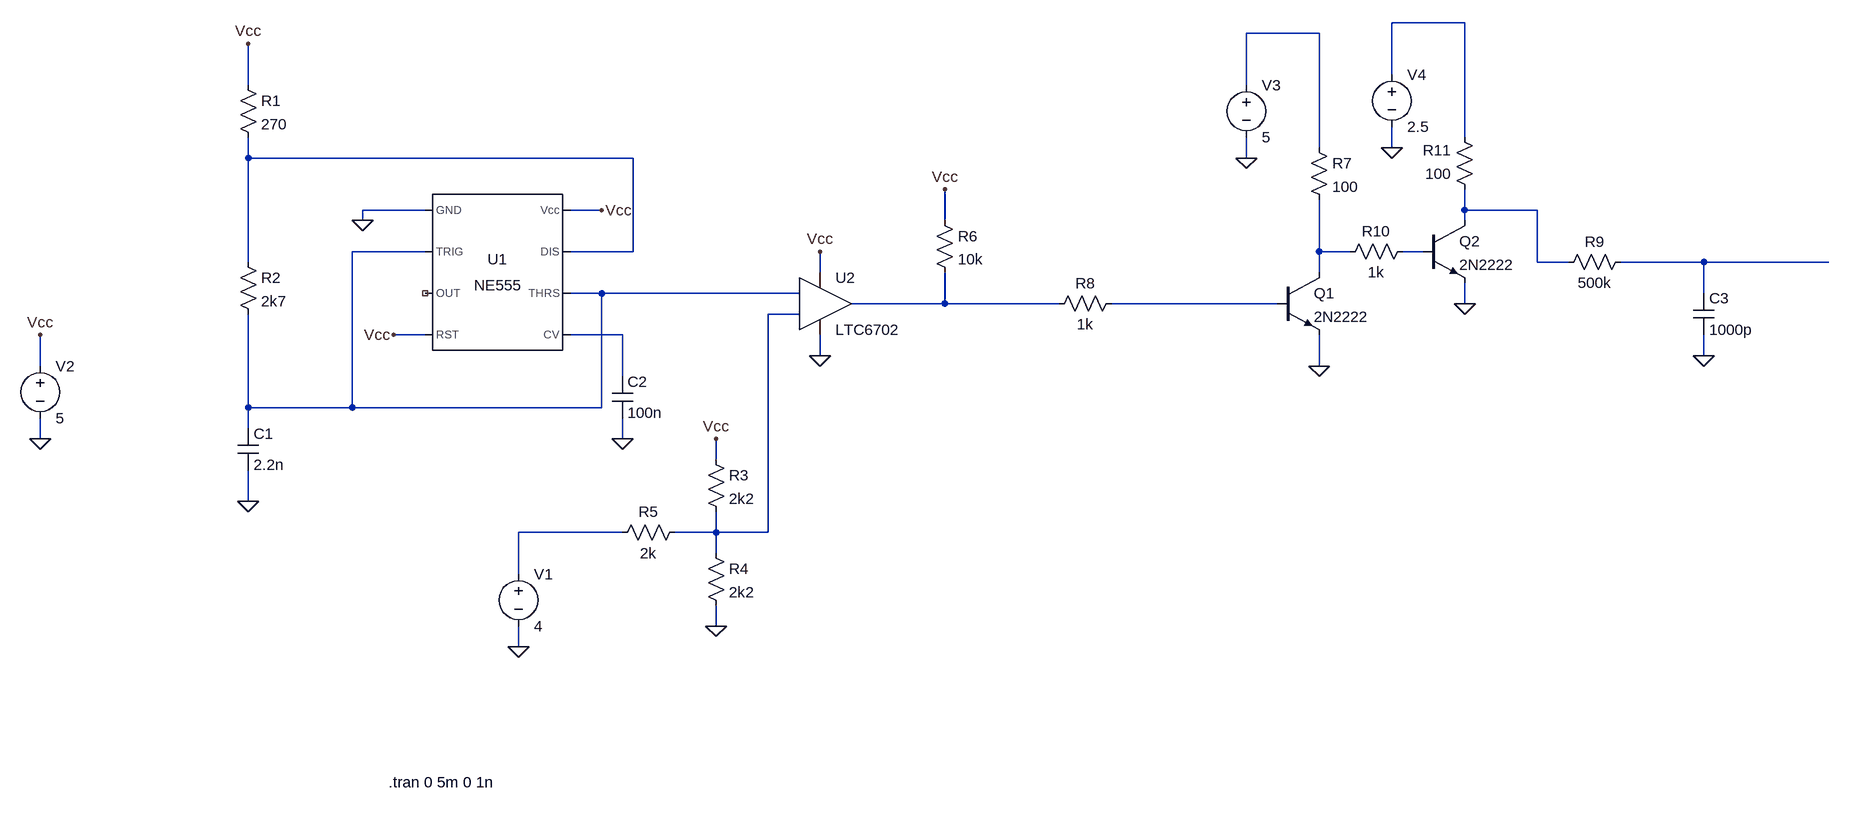
[diagram p0: schematic Gerador_PWM.asc]
Gerador_PWM.asc, the LTspice schematic file:
Version 4
SHEET 1 2724 736
WIRE 1440 -448 1328 -448
WIRE 1216 -432 1104 -432
WIRE 1328 -368 1328 -448
WIRE -432 -352 -432 -416
WIRE 1104 -352 1104 -432
WIRE 1440 -272 1440 -448
WIRE 1216 -256 1216 -432
WIRE 1328 -256 1328 -288
WIRE -432 -240 -432 -272
WIRE 160 -240 -432 -240
WIRE 1104 -240 1104 -272
WIRE -160 -160 -256 -160
WIRE 112 -160 64 -160
WIRE 1440 -160 1440 -192
WIRE 1552 -160 1440 -160
WIRE -256 -144 -256 -160
WIRE 640 -144 640 -192
WIRE 1440 -144 1440 -160
WIRE -160 -96 -272 -96
WIRE 160 -96 160 -240
WIRE 160 -96 64 -96
WIRE 1216 -96 1216 -176
WIRE 1264 -96 1216 -96
WIRE 1376 -96 1344 -96
WIRE -432 -80 -432 -240
WIRE 1552 -80 1552 -160
WIRE 1600 -80 1552 -80
WIRE 1808 -80 1680 -80
WIRE 2000 -80 1808 -80
WIRE 448 -64 448 -96
WIRE 1216 -64 1216 -96
WIRE 112 -32 64 -32
WIRE 416 -32 112 -32
WIRE 1808 -32 1808 -80
WIRE 640 -16 640 -64
WIRE 640 -16 496 -16
WIRE 816 -16 640 -16
WIRE 1152 -16 896 -16
WIRE 1440 -16 1440 -48
WIRE 416 0 368 0
WIRE -160 32 -208 32
WIRE 144 32 64 32
WIRE 448 64 448 32
WIRE 1808 64 1808 32
WIRE -752 80 -752 32
WIRE 1216 80 1216 32
WIRE 144 96 144 32
WIRE -432 144 -432 0
WIRE -272 144 -272 -96
WIRE -272 144 -432 144
WIRE 112 144 112 -32
WIRE 112 144 -272 144
WIRE -432 176 -432 144
WIRE -752 192 -752 160
WIRE 144 192 144 160
WIRE 288 224 288 192
WIRE -432 288 -432 240
WIRE 144 336 -16 336
WIRE 288 336 288 304
WIRE 288 336 224 336
WIRE 368 336 368 0
WIRE 368 336 288 336
WIRE 288 368 288 336
WIRE -16 400 -16 336
WIRE 288 480 288 448
WIRE -16 512 -16 480
FLAG -432 288 0
FLAG -256 -144 0
FLAG 144 192 0
FLAG -432 -416 Vcc
FLAG 112 -160 Vcc
FLAG -208 32 Vcc
FLAG 448 64 0
FLAG 448 -96 Vcc
FLAG -16 512 0
FLAG 640 -192 Vcc
FLAG 288 480 0
FLAG 288 192 Vcc
FLAG -752 192 0
FLAG -752 32 Vcc
FLAG 1104 -240 0
FLAG 1216 80 0
FLAG 1808 64 0
FLAG 1328 -256 0
FLAG 1440 -16 0
SYMBOL Misc\\NE555 -48 -64 R0
SYMATTR InstName U1
SYMBOL res -448 -368 R0
SYMATTR InstName R1
SYMATTR Value 270
SYMBOL res -448 -96 R0
SYMATTR InstName R2
SYMATTR Value 2k7
SYMBOL cap -448 176 R0
SYMATTR InstName C1
SYMATTR Value 2.2n
SYMBOL cap 128 96 R0
SYMATTR InstName C2
SYMATTR Value 100n
SYMBOL res 272 208 R0
SYMATTR InstName R3
SYMATTR Value 2k2
SYMBOL res 272 352 R0
SYMATTR InstName R4
SYMATTR Value 2k2
SYMBOL res 240 320 R90
WINDOW 0 0 56 VBottom 2
WINDOW 3 32 56 VTop 2
SYMATTR InstName R5
SYMATTR Value 2k
SYMBOL voltage -16 384 R0
WINDOW 123 0 0 Left 0
WINDOW 39 0 0 Left 0
SYMATTR InstName V1
SYMATTR Value 4
SYMBOL res 624 -160 R0
SYMATTR InstName R6
SYMATTR Value 10k
SYMBOL voltage -752 64 R0
WINDOW 123 0 0 Left 0
WINDOW 39 0 0 Left 0
SYMATTR InstName V2
SYMATTR Value 5
SYMBOL Comparators\\LTC6702 448 -16 R0
SYMATTR InstName U2
SYMBOL npn 1152 -64 R0
SYMATTR InstName Q1
SYMATTR Value 2N2222
SYMBOL voltage 1104 -368 R0
WINDOW 123 0 0 Left 0
WINDOW 39 0 0 Left 0
SYMATTR InstName V3
SYMATTR Value 5
SYMBOL cap 1792 -32 R0
SYMATTR InstName C3
SYMATTR Value 1000p
SYMBOL res 1696 -96 R90
WINDOW 0 0 56 VBottom 2
WINDOW 3 32 56 VTop 2
SYMATTR InstName R9
SYMATTR Value 500k
SYMBOL res 1200 -272 R0
SYMATTR InstName R7
SYMATTR Value 100
SYMBOL res 912 -32 R90
WINDOW 0 0 56 VBottom 2
WINDOW 3 32 56 VTop 2
SYMATTR InstName R8
SYMATTR Value 1k
SYMBOL npn 1376 -144 R0
SYMATTR InstName Q2
SYMATTR Value 2N2222
SYMBOL res 1360 -112 R90
WINDOW 0 0 56 VBottom 2
WINDOW 3 32 56 VTop 2
SYMATTR InstName R10
SYMATTR Value 1k
SYMBOL res 1456 -176 R180
WINDOW 0 36 76 Left 2
WINDOW 3 36 40 Left 2
SYMATTR InstName R11
SYMATTR Value 100
SYMBOL voltage 1328 -384 R0
WINDOW 123 0 0 Left 0
WINDOW 39 0 0 Left 0
SYMATTR InstName V4
SYMATTR Value 2.5
TEXT -216 720 Left 2 !.tran 0 5m 0 1n

The netlist it stands for:
* Gerador_PWM.asc
XU1 0 N005 NC_01 Vcc N012 N005 N003 Vcc NE555  ; pins GND TRIG OUT RST CV THRS DIS Vcc
R1 Vcc N003 270
R2 N003 N005 2k7
C1 N005 0 2.2n
C2 N012 0 100n
R3 Vcc N011 2k2
R4 N011 0 2k2
R5 N011 N013 2k
V1 N013 0 4
R6 Vcc N009 10k
V2 Vcc 0 5
XU2 N011 N005 Vcc 0 N009 LTC6702
Q1 N006 N010 0 0 2N2222
V3 N002 0 5
C3 N008 0 1000p
R9 N008 N004 500k
R7 N002 N006 100
R8 N010 N009 1k
Q2 N004 N007 0 0 2N2222
R10 N007 N006 1k
R11 N004 N001 100
V4 N001 0 2.5
.model NPN NPN
.model PNP PNP
.lib standard.bjt
.tran 0 5m 0 1n
.lib NE555.sub
.lib LTC3.lib
.backanno
.end